# Altium schematic sheet Power.SchDoc
size 431 x 279 mm; SheetNumber: 3; SheetTotal: 4; SheetTitle: Power
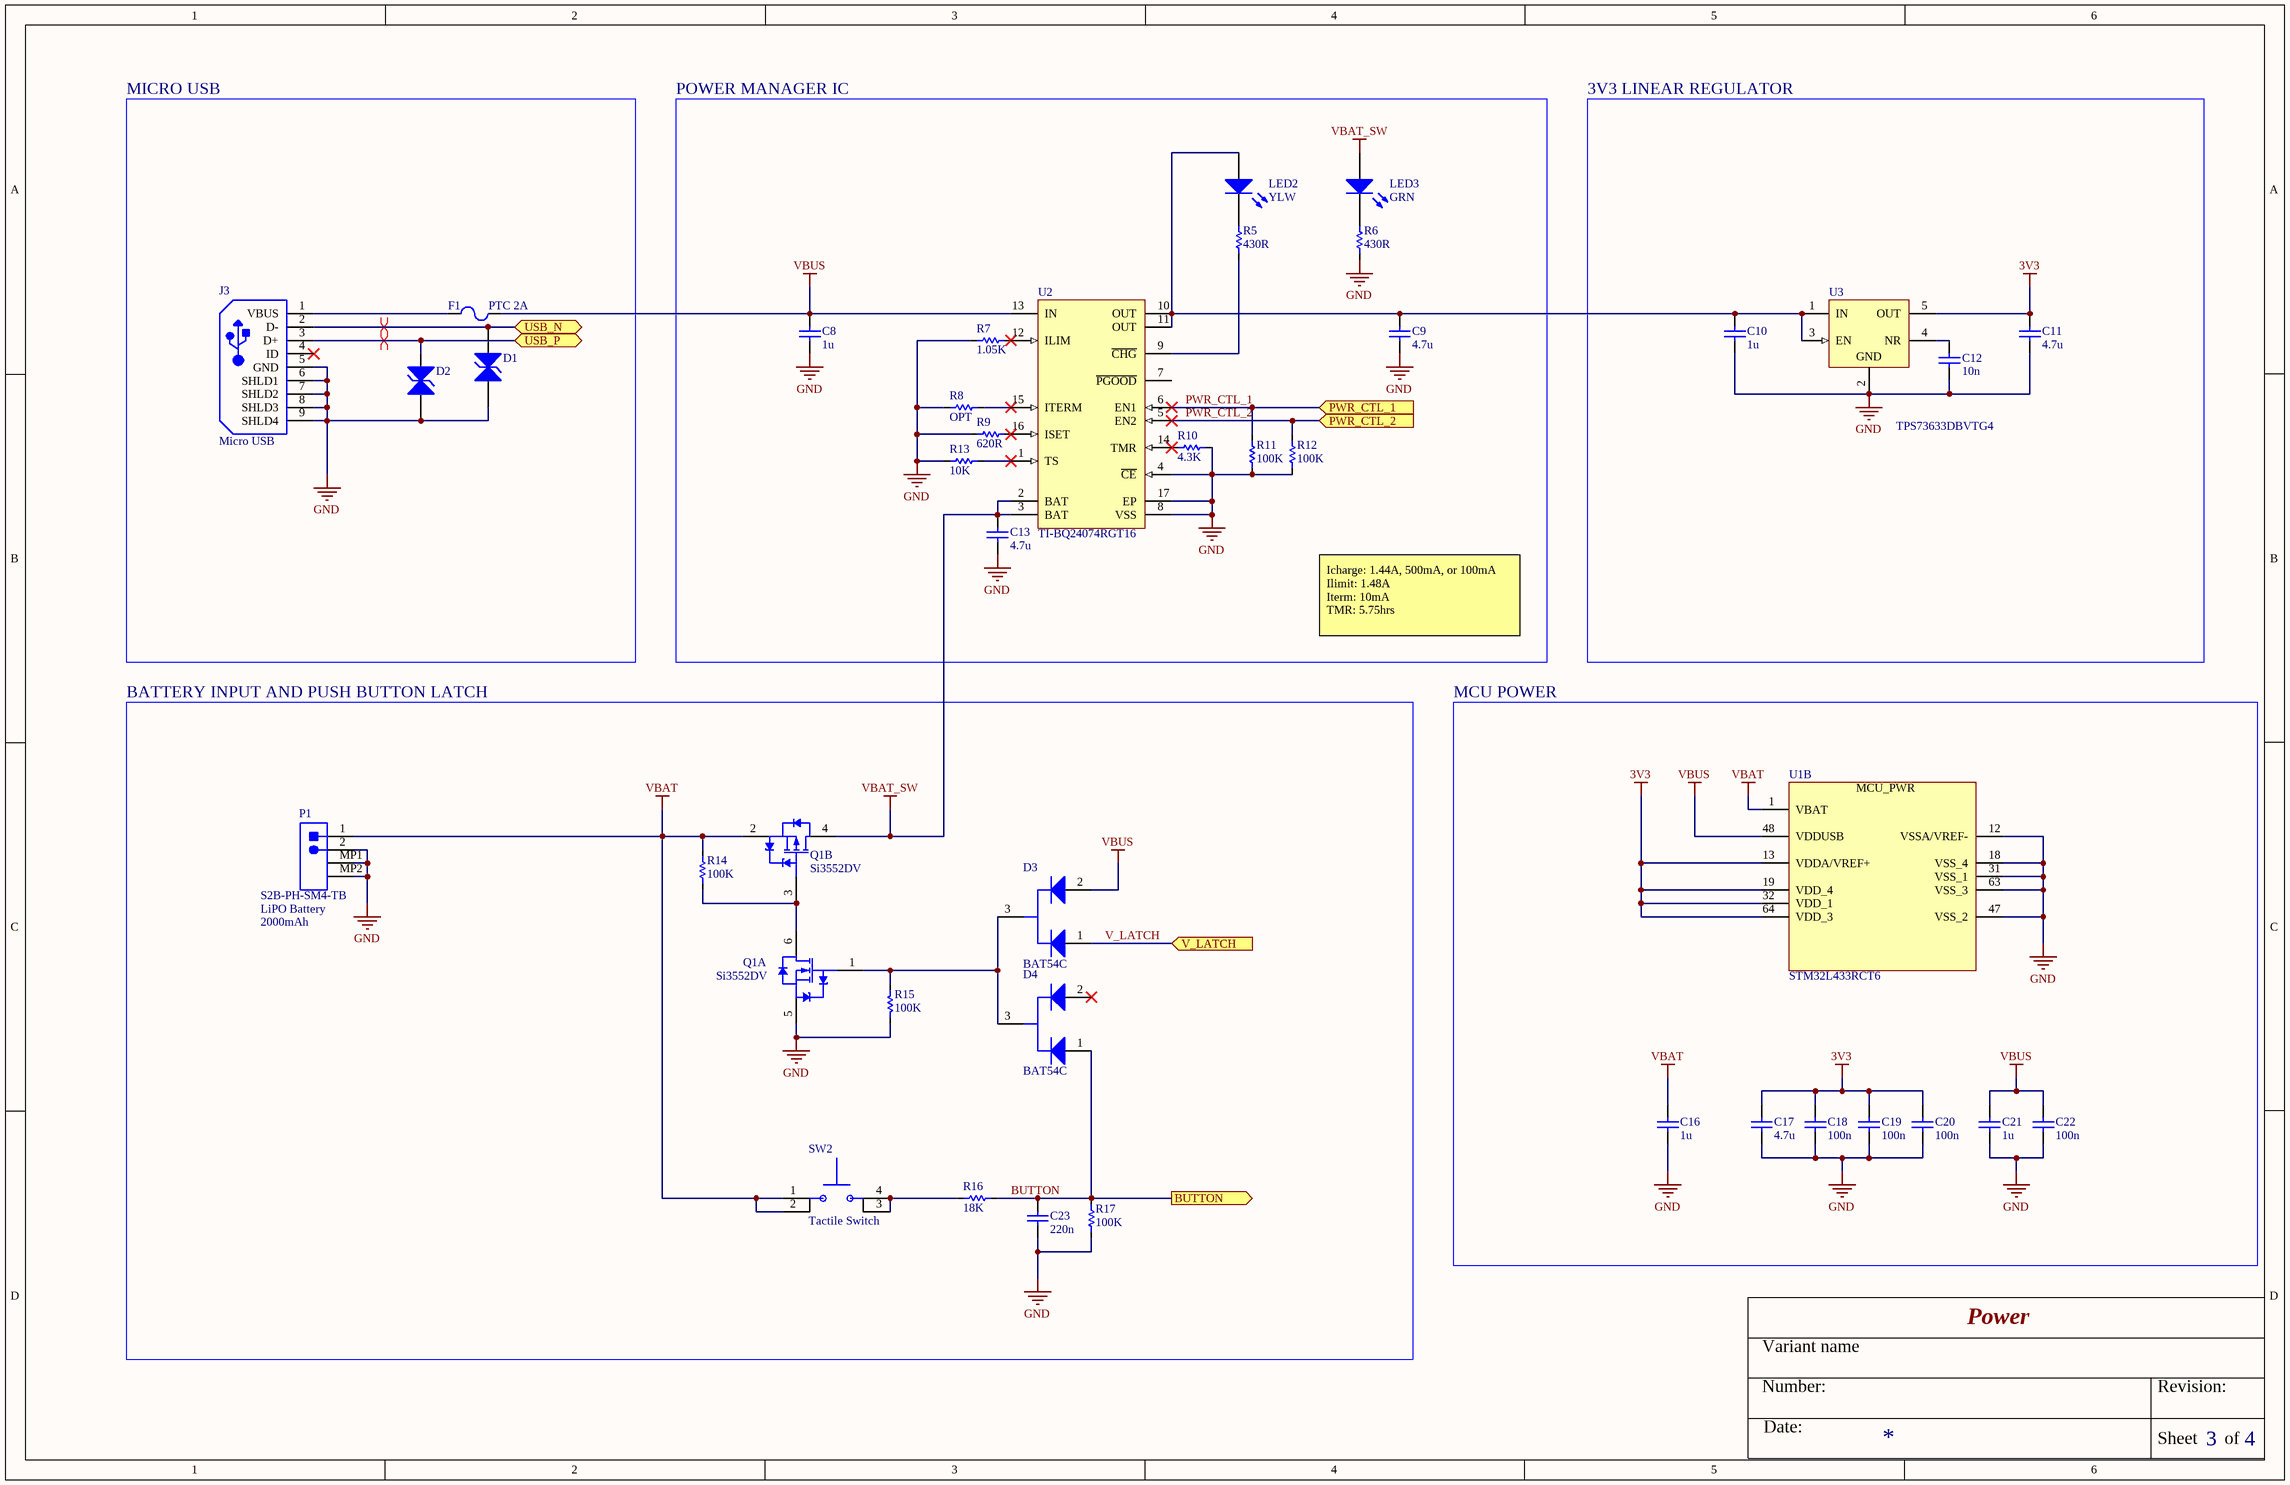
[diagram p0: Power.SchDoc]

## Parts
C8  1u  [CAP_0603_M]
C9  4.7u  [CAP_0603_M]
C10  1u  [CAP_0603_M]
C11  4.7u  [CAP_0603_M]
C12  10n  [CAP_0603_M]
C13  4.7u  [CAP_0603_M]
C16  1u  [CAP_0603_M]
C17  4.7u  [CAP_0603_M]
C18  100n  [CAP_0603_M]
C19  100n  [CAP_0603_M]
C20  100n  [CAP_0603_M]
C21  1u  [CAP_0603_M]
C22  100n  [CAP_0603_M]
C23  220n  [CAP_0603_M]
D1  PGB1010402KR  [LFUS-PGB1010402KR-2_V]  (value not drawn)
D2  PGB1010402KR  [LFUS-PGB1010402KR-2_V]  (value not drawn)
D3  BAT54C  [ONSC-BAT54CL_SOT-23]
D4  BAT54C  [ONSC-BAT54CL_SOT-23]
F1  PTC 2A  [PTC_1206_M]
J3  Micro USB  [HIRO-ZX62D-B-5P8_V]
LED2  YLW  [0603_A]
LED3  GRN  [0603_A]
P1  S2B-PH-SM4-TB  [JST- S2B-PH-SM4-TB(LF)(SN)-2_V]
Q1  Si3552DV  [VISHAY-TSOP6]  (parts A,B of 2)
R5  430R  [RES_0603_M]
R6  430R  [RES_0603_M]
R7  1.05K  [RES_0603_M]
R8  OPT  [RES_0603_M]
R9  620R  [RES_0603_M]
R10  4.3K  [RES_0603_M]
R11  100K  [RES_0603_M]
R12  100K  [RES_0603_M]
R13  10K  [RES_0603_M]
R14  100K  [RES_0603_M]
R15  100K  [RES_0603_M]
R16  18K  [RES_0603_M]
R17  100K  [RES_0603_M]
SW2  Tactile Switch  [E-Switch_TL6120DF300QG]
U1  STM32L433RCT6  [ICC_LQFP64_10X10_P050]  (part B of 2)
U2  TI-BQ24074RGT16  [TI-BQ24074RGT16]
U3  TPS73633DBVTG4  [TI-DBV5_M]

## Blocks framed on the sheet
MICRO USB: D1 D2 F1 J3
POWER MANAGER IC: C8 C9 C13 LED2 LED3 R5-R13 U2
3V3 LINEAR REGULATOR: C10-C12 U3
BATTERY INPUT AND PUSH BUTTON LATCH: C23 D3 D4 P1 Q1 R14-R17 SW2
MCU POWER: C16-C22 U1

## Ports
BUTTON (out), PWR_CTL_1 (in), PWR_CTL_2 (in), USB_N (bidir), USB_P (bidir), V_LATCH (in)

## Nets
3V3: C11.2 C17.2 C18.2 C19.2 C20.2 U1.13(VDDA/VREF+) U1.19(VDD_4) U1.32(VDD_1) U1.64(VDD_3) U3.5(OUT)
GND: C8.1 C9.1 C10.1 C11.1 C12.1 C13.1 C16.1 C17.1 C18.1 C19.1 C20.1 C21.1 C22.1 C23.1 D1.1(A1) D2.1(A1) J3.5(GND) J3.6(SHLD1) J3.7(SHLD2) J3.8(SHLD3) J3.9(SHLD4) P1.2 P1.MP1 P1.MP2 Q1.5(S1) R6.1 R7.1 R8.1 R9.1 R10.2 R11.1 R12.2 R13.1 R15.1 R17.1 U1.12(VSSA/VREF-) U1.18(VSS_4) U1.31(VSS_1) U1.47(VSS_2) U1.63(VSS_3) U2.4(~{CE}) U2.8(VSS) U2.17(EP) U3.2(GND)
VBAT: C16.2 P1.1 Q1.2(S2) R14.2 SW2.1 SW2.2 U1.1(VBAT)
VBAT_SW: C13.2 LED3.2(A) Q1.4(D2) U2.2(BAT) U2.3(BAT)
VBUS: C8.2 C21.2 C22.2 D3.2(A2) F1.2 U1.48(VDDUSB) U2.13(IN)
BUTTON: C23.2 D4.1(A1) R16.2 R17.2 ; port BUTTON
PWR_CTL_1: R11.2 U2.6(EN1) ; port PWR_CTL_1
PWR_CTL_2: R12.1 U2.5(EN2) ; port PWR_CTL_2
USB_N: D1.2(A2) J3.2(D-) ; port USB_N
USB_P: D2.2(A2) J3.3(D+) ; port USB_P
V_LATCH: D3.1(A1) ; port V_LATCH
NetC9_2: C9.2 C10.2 LED2.2(A) U2.10(OUT) U2.11(OUT) U3.1(IN) U3.3(EN)
NetC12_2: C12.2 U3.4(NR)
NetD3_3: D3.3(K) D4.3(K) Q1.1(G1) R15.2
NetF1_1: F1.1 J3.1(VBUS)
NetLED2_1: LED2.1(K) R5.2
NetLED3_1: LED3.1(K) R6.2
NetQ1_3: Q1.3(G2) Q1.6(D1) R14.1
NetR5_1: R5.1 U2.9(~{CHG})
NetR7_2: R7.2 U2.12(ILIM)
NetR8_2: R8.2 U2.15(ITERM)
NetR9_2: R9.2 U2.16(ISET)
NetR10_1: R10.1 U2.14(TMR)
NetR13_2: R13.2 U2.1(TS)
NetR16_1: R16.1 SW2.3 SW2.4

Not connected (* = marked no-connect by the designer): D4 2(A2)*; J3 4(ID)*; U2 7(~{PGOOD})

## Layout directives
differential pair: USB_N, USB_P

## Notes on the sheet
- Icharge: 1.44A, 500mA, or 100mA
  Ilimit: 1.48A
  Iterm: 10mA
  TMR: 5.75hrs
- (near P1) LiPO Battery
- (near P1) 2000mAh
- Variant name
- Number:
- Date:
- Revision:
- Sheet
- of
- (in symbol STM32L433RCT6, part B) MCU_PWR

## Library data of the parts
C8 = CAP_0603: CAP 1uF 10V 20% X7R 0603; Category: capacitor; Created: 2018-07-01; Created By: JS; Last Modified: 2018-07-01
C9 C11 C13 C17 = CAP_0603: CAP 4.7uF 6.3V 20% X7R 0603; Category: capacitor; Created: 2018-07-01; Created By: JS; Last Modified: 2018-07-01
C10 C16 C21 = CAP_0603: CAP 1uF 6.3V 20% X7R 0603; Category: capacitor; Created: 2018-07-01; Created By: JS; Last Modified: 2018-07-01
C12 = CAP_0603: CAP 10nF 6.3V 20% X7R 0603; Category: capacitor; Created: 2018-07-01; Created By: JS; Last Modified: 2018-07-01
C18-C20 C22 = CAP_0603: CAP 100nF 6.3V 20% X7R 0603; Category: capacitor; Created: 2018-07-01; Created By: JS; Last Modified: 2018-07-01
C23 = CAP_0603: CAP 220nF 6.3V 20% X7R 0603; Category: capacitor; Created: 2018-07-01; Created By: JS; Last Modified: 2018-07-01
D1 D2 = CMP-2000-05189-1: TVS, Polymeric ESD Suppressor, 12 V, -65 to 125 degC, 2-Pin SMD; Manufacturer: Littelfuse; Reverse Stand-off Voltage: 12V; Configuration: Single; Product Height (mm): 0.36mm; Product Length (mm): 1.66mm; Clamping Voltage (Max): 250V(Typ); Direction Type: Bi-Directional; Number of Elements: 1; Leakage Current: 0.001uA; Rad Hardened: No; Product Depth (mm): 0.84mm; Capacitance Value: 0.04pF; Operating Temp Range: -65Cto125C; Operating Temperature Max Deg. C: 125C; Datasheet Version: May-09; Manufacturer URL: http://www.littelfuse.com/; Packaging: TapeandReel; Package / Case: SMD; Working Voltage (Max): 12V; Operating Temperature Min Deg. C: -65C; Mounting Style: SurfaceMount; Datasheet URL: https://datasheet.ciiva.com/5837/575761-5837954.pdf; Operating Temperature Classification: Military; Pin Count: 2; Mounting: SurfaceMount; Leakage Current (Max): 0.001uA; Clamping Voltage: 250V(Typ); Suppressor Type: Polymer; Polarity: Bi-Directional; Working Voltage: 12V
D3 D4 = ONSC-D-A1A2K3-3
F1 = BEL_PTC_0ZCJ0200FF2C: PTC RESET FUSE 6V 2A 1206
J3 = HIRO-ZX62D-B-5P8_V: Micro-USB Connector, 9-Leads, Body 7.5x5.6mm, Pitch 0.65mm
LED2 = CMP-1426-00005-1: SMD mono-color Chip LED, WL-SMCW, Yellow; PartNumber: 150060YS75000; Manufacturer: Wuerth Elektronik; ComponentLink1URL: http://www.we-online.com; Color: Yellow; ComponentLink2Description: Datasheet; ComponentLink2URL: http://katalog.we-online.com/led/datasheet/150060YS75000.pdf; ComponentLink1Description: Manufacturer URL; PackageReference: 0603_A
LED3 = CMP-1426-00005-1: SMD LED Green 0603; PartNumber: 150060YS75000; Manufacturer: Wuerth Elektronik; Color: Yellow; ComponentLink1URL: http://www.we-online.com; ComponentLink2Description: Datasheet; ComponentLink2URL: http://katalog.we-online.com/led/datasheet/150060YS75000.pdf; ComponentLink1Description: Manufacturer URL; PackageReference: 0603_A
P1 = CMP-1755-00001-1: Male Header, Pitch 2 mm, 1 x 2 Position, Height 5.5 mm, -25 to 85 degC, RoHS, Tape and Reel; Current Rating: 3 A; ComponentLink1URL: http://www.jst.com/home2.html; Radiation Hardening: No; RoHSCompliant: True; Mount: Through Hole; Contact Material: Bronze; Package Quantity: 100; Width: 2.34 mm; DatasheetVersion: Dec-12; Height: 8.13 mm; Max Operating Temperature: 105degC; ComponentLink2Description: Datasheet; Lead Pitch: 0.1 inch; Contact Finish: Lead; Packaging: Bulk; Colour: Black; Contact Plating: Tin; Min Operating Temperature: -65degC; ComponentLink1Description: Manufacturer URL; PackageReference: S2B-PH-SM4-TB(LF)(SN)-2; PackageDescription: Male Header, Pitch 2 mm, 1 x 2 Position, Height 5.5 mm; ComponentLink2URL: http://www.jst-mfg.com/product/pdf/eng/ePH.pdf; Pins: 40; Length: 101.19 mm
Q1 = VISHAY_Si3552DV: N/P-Channel Mosfet 30V, 2.5A/-1.8A; Manufacturer: Vishay; Rds_N: 85mOhm; Rds_P: 165mOhm; Vgs(th): 1V; Manufacturer PN: Si3552DV; Vmax: 30V
R5 R6 = RES_0603: RES 430R 1/5W 0603; Manufacturer: *; Manufacturer PN: *; Category: resistor; Created: 2018-07-01; Last Modified: 2018-07-01; Created By: JS
R7 = RES_0603: RES 1.05K 1/5W 0603; Manufacturer: *; Manufacturer PN: *; Category: resistor; Created: 2018-07-01; Last Modified: 2018-07-01; Created By: JS
R8 = RES_0603: REMOVE; Manufacturer: *; Manufacturer PN: *; Category: resistor; Created: 2018-07-01; Last Modified: 2018-07-01; Created By: JS
R9 = RES_0603: RES 620R 1/5W 0603; Manufacturer: *; Manufacturer PN: *; Category: resistor; Created: 2018-07-01; Last Modified: 2018-07-01; Created By: JS
R10 = RES_0603: RES 4.3K 1/5W 0603; Manufacturer: *; Manufacturer PN: *; Category: resistor; Created: 2018-07-01; Last Modified: 2018-07-01; Created By: JS
R11 R12 R14 R15 R17 = RES_0603: RES 100K 1/5W 0603; Manufacturer: *; Manufacturer PN: *; Category: resistor; Created: 2018-07-01; Last Modified: 2018-07-01; Created By: JS
R13 = RES_0603: RES 10K 1/5W 0603; Manufacturer: *; Manufacturer PN: *; Category: resistor; Created: 2018-07-01; Last Modified: 2018-07-01; Created By: JS
R16 = RES_0603: RES 18K 1/5W 0603; Manufacturer: *; Manufacturer PN: *; Category: resistor; Created: 2018-07-01; Last Modified: 2018-07-01; Created By: JS
SW2 = E-Switch_TL6120DF300QG: SWITCH TACTILE SPST-NO 0.05A 50V, Body=7.4x7.4mm; Manufacturer: E-Switch; Manufacturer PN: TL6120DF300QG
U1 = STM32L433RCT6: Microcontroller 256_STM32L433 . LQFP64 package; Internal_Part_Number: MCD-00548; Part_Type: IC; Manufacturer: STMICROELECTRONICS; ECCN_US: 3A991A2; ECCN_EU: NEC; Provided_By: STM; Initial_Board_Reference: mb1319; Status: Symbol available; Manufacturer_Part_Number: STM32L433RCT6; Value: STM32L433RCT6
U2 = TI-BQ24074RGT16: PMIC 1.5A Li-Ion Battery Charger; Manufacturer: TI; Manufacturer PN: BQ24074RGT16
U3 = CMP-0395-00250-1: Single Output Low Noise LDO, 400 mA, Fixed 3.3 V Output, 1.7 to 5.5 V Input, with Reverse Current Protection, 5-pin SOT-23 (DBV), -40 to 85 degC,; Manufacturer: Texas Instruments; Vdo(Typ)(mV): 75; Vout Adj(Min)(V): 3.3; Rating: Catalog; Vin(Min)(V): 1.7; Iout(Max)(A): 0.4; Vin(Max)(V): 5.5; Iq(Typ)(mA): 0.3; SubFamily: Single Channel LDO; Eco-Plan: Green (RoHS & no Sb/Br); Accuracy(%): 1; ComponentLink2URL: http://www.ti.com/general/docs/lit/getliterature.tsp?genericPartNumber=TPS73633&fileType=pdf; ComponentLink1URL: http://www.ti.com/; ComponentLink2Description: Datasheet; DatasheetVersion: SBVS038T; Mounting Technology: Surface Mount; Fixed Output Options(V): 3.3; ComponentLink3Description: Package Specification; ComponentLink3URL: http://www.ti.com/litv/pdf/mpds018i; ComponentLink4Description: URL Link1; PackageReference: DBV5; ComponentLink4URL: Samples URL:http://www.ti.com/product/tps73633#samples; Vout Adj(Max)(V): 3.3; PackageVersion: 4073253-4/K; PackageDescription: 5-Pin Plastic Small Outline, Body 1.60 Ãƒâ€” 2.90 mm, Pitch 0.95 mm; ComponentLink1Description: Manufacturer URL; Code_JEDEC: MO-178; PartNumber: TPS73633DBVTG4